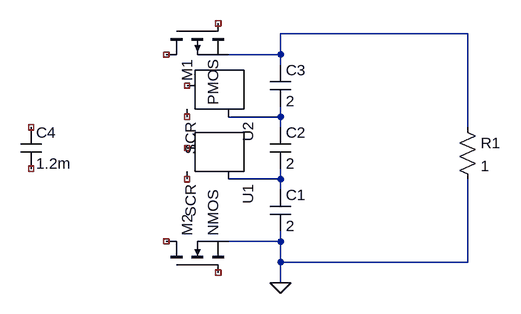
[diagram p0: schematic pump.asc]
pump.asc, the LTspice schematic file:
Version 4
SHEET 1 884 680
WIRE 832 112 544 112
WIRE 544 144 544 112
WIRE 544 144 464 144
WIRE 544 160 544 144
WIRE 544 240 544 224
WIRE 544 240 464 240
WIRE 544 256 544 240
WIRE 832 256 832 112
WIRE 544 336 544 320
WIRE 544 336 464 336
WIRE 544 352 544 336
WIRE 544 432 544 416
WIRE 544 432 464 432
WIRE 544 464 544 432
WIRE 832 464 832 336
WIRE 832 464 544 464
WIRE 544 496 544 464
FLAG 544 496 0
SYMBOL cap 528 352 R0
SYMATTR InstName C1
SYMATTR Value 2
SYMATTR SpiceLine Rser=.1
SYMBOL cap 528 256 R0
SYMATTR InstName C2
SYMATTR Value 2
SYMATTR SpiceLine Rser=.1
SYMBOL cap 528 160 R0
SYMATTR InstName C3
SYMATTR Value 2
SYMATTR SpiceLine Rser=.1
SYMBOL cap 144 256 R0
SYMATTR InstName C4
SYMATTR Value 1.2m
SYMATTR SpiceLine Rser=.5
SYMBOL res 816 240 R0
SYMATTR InstName R1
SYMATTR Value 1
SYMBOL Misc/SCR 464 320 R90
SYMATTR InstName U1
SYMBOL Misc/SCR 464 224 R90
SYMATTR InstName U2
SYMBOL pmos 368 96 M90
SYMATTR InstName M1
SYMBOL nmos 368 480 R270
SYMATTR InstName M2

The netlist it stands for:
* pump.asc
C1 N003 0 2 Rser=.1
C2 N002 N003 2 Rser=.1
C3 N001 N002 2 Rser=.1
C4 NC_01 NC_02 1.2m Rser=.5
R1 N001 0 1
* U1: SCR (symbol Misc/SCR not certain, pin order unknown); nets seen at it: N003
* U2: SCR (symbol Misc/SCR not certain, pin order unknown); nets seen at it: N002
M1 NC_07 NC_08 N001 N001 PMOS
M2 NC_09 NC_10 0 0 NMOS
.model NMOS NMOS
.model PMOS PMOS
.lib standard.mos
.backanno
.end